# Altium schematic sheet NCS_wireless_display_raw1.SchDoc
size A
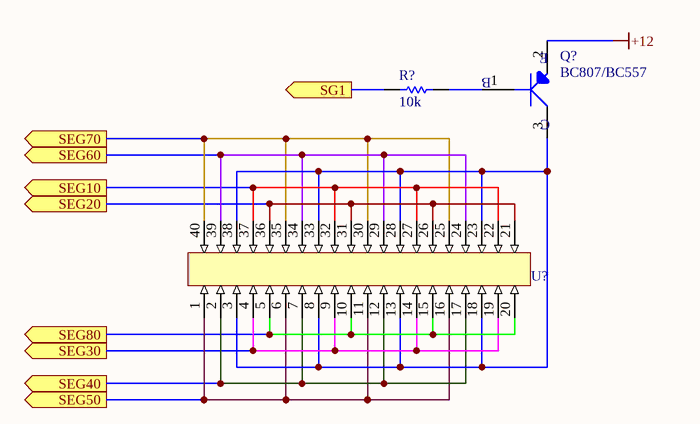
[diagram p0: NCS_wireless_display_raw1.SchDoc]

## Parts
Q?  BC807/BC557  [BC807/BC557_SOT23]
R?  10k  [RC0805FR-7W330RL]
U?  40 Pin IC Base  [DIP40]  (value not drawn)

## Ports
SEG10 (out), SEG20 (out), SEG30 (out), SEG40 (out), SEG50 (out), SEG60 (out), SEG70 (out), SEG80 (out), SG1 (out)

## Nets
+12: Q?.2(E)
SEG10: U?.22 U?.27 U?.32 U?.37 ; port SEG10
SEG20: U?.21 U?.26 U?.31 U?.36 ; port SEG20
SEG30: U?.4 U?.9 U?.14 U?.19 ; port SEG30
SEG40: U?.2 U?.7 U?.12 U?.17 ; port SEG40
SEG50: U?.1 U?.6 U?.11 U?.16 ; port SEG50
SEG60: U?.24 U?.29 U?.34 U?.39 ; port SEG60
SEG70: U?.25 U?.30 U?.35 U?.40 ; port SEG70
SEG80: U?.5 U?.10 U?.15 U?.20 ; port SEG80
SG1: R?.1 ; port SG1
NetQ?_1: Q?.1(B) R?.2
NetQ?_3: Q?.3(C) U?.3 U?.8 U?.13 U?.18 U?.23 U?.28 U?.33 U?.38

## Library data of the parts
Q? = BC807-25LT1G: Trans GP BJT PNP 45V 0.5A 3-Pin SOT-23 T/R - Product that comes on tape, but is not reeled; Manufacturer: ON Semiconductor; Supplier 1: Arrow Electronics; Manufacturer Part Number: BC807-25LT1G; RoHS: Yes; Category: BJTs; Stock 1: 2607000; Pricing 1: 3000=0.0196, 9000=0.0143 (USD); ComponentLink1URL: https://datasheet.ciiva.com/15138/getdatasheetpartid-32011-15138578.pdf?src-supplier=Verical; ComponentLink1Description: https://datasheet.ciiva.com/15138/getdatasheetpartid-32011-15138578.pdf?src-supplier=Verical; ComponentLink2URL: https://datasheet.ciiva.com/4722/bc807-16lt1-d-106678-4722830.pdf?src-supplier=Mouser; ComponentLink2Description: https://datasheet.ciiva.com/4722/bc807-16lt1-d-106678-4722830.pdf?src-supplier=Mouser; ComponentLink3URL: https://datasheet.ciiva.com/7972/bc807-16lt1-d-7972185.pdf?src-supplier=Element14; ComponentLink3Description: https://datasheet.ciiva.com/7972/bc807-16lt1-d-7972185.pdf?src-supplier=Element14; ComponentLink4URL: https://datasheet.ciiva.com/11197/bc807-16lt1-d-11197499.pdf?src-supplier=Avnet; ComponentLink4Description: https://datasheet.ciiva.com/11197/bc807-16lt1-d-11197499.pdf?src-supplier=Avnet; ComponentLink5URL: https://datasheet.ciiva.com/11197/bc807-16lt1-d-11197830.pdf?src-supplier=Avnet; ComponentLink5Description: https://datasheet.ciiva.com/11197/bc807-16lt1-d-11197830.pdf?src-supplier=Avnet; ComponentLink6URL: https://datasheet.ciiva.com/5720/bc807-16lt1-d-5720171.pdf?src-supplier=Farnell; ComponentLink6Description: https://datasheet.ciiva.com/5720/bc807-16lt1-d-5720171.pdf?src-supplier=Farnell; ComponentLink7URL: https://datasheet.ciiva.com/976/bc807-16lt1-d-976425.pdf?src-supplier=Digikey; ComponentLink7Description: https://datasheet.ciiva.com/976/bc807-16lt1-d-976425.pdf?src-supplier=Digikey; ComponentLink8URL: https://datasheet.ciiva.com/976/bc807-16lt1-d-976426.pdf?src-supplier=Digikey; ComponentLink8Description: https://datasheet.ciiva.com/976/bc807-16lt1-d-976426.pdf?src-supplier=Digikey; ComponentLink9URL: https://datasheet.ciiva.com/976/bc807-16lt1-d-976427.pdf?src-supplier=Digikey; ComponentLink9Description: https://datasheet.ciiva.com/976/bc807-16lt1-d-976427.pdf?src-supplier=Digikey; ComponentLink10URL: https://datasheet.ciiva.com/16205/bc807-16lt1-d-16205062.pdf?src-supplier=Future+Electronics; ComponentLink10Description: https://datasheet.ciiva.com/16205/bc807-16lt1-d-16205062.pdf?src-supplier=Future+Electronics; Supplier Part Number 1: BC807-25LT1G
R? = RC0805FR-7W330RL: Res Thick Film 0805 330 Ohm 1% 0.25W(1/4W) ±200ppm/C Pad SMD T/R; Manufacturer: Yageo; Value: 330R; Supplier: Digikey; Supplier Part Number: 13-RC0805FR-7W330RLCT-ND; Manufacturer Part Number: RC0805FR-7W330RL; RoHS: Yes; Category: Chip SMD Resistors; Stock: 5595; Pricing: 1=0.17, 10=0.057, 50=0.046, 100=0.0347, 500=0.03264, 1000=0.0306 (USD); Case/Package: 339Case; Packaging: 10Packaging